# Altium schematic sheet Conditioning.SchDoc
size 381 x 279 mm; Organization: SACO Technologies; Address1: 7806, Trans-Canada Hwy; Address2: Montreal, QC, Canada - H4S1L3.; Address3: H4S1L3; SheetNumber: 4; SheetTotal: 6; ELE682ProjectName: Conditioning & TLL PCB; ProjectRevision: C; SchDesignedBy1: Alexis Gagnon; SchDesignedBy2: Megane Cyr
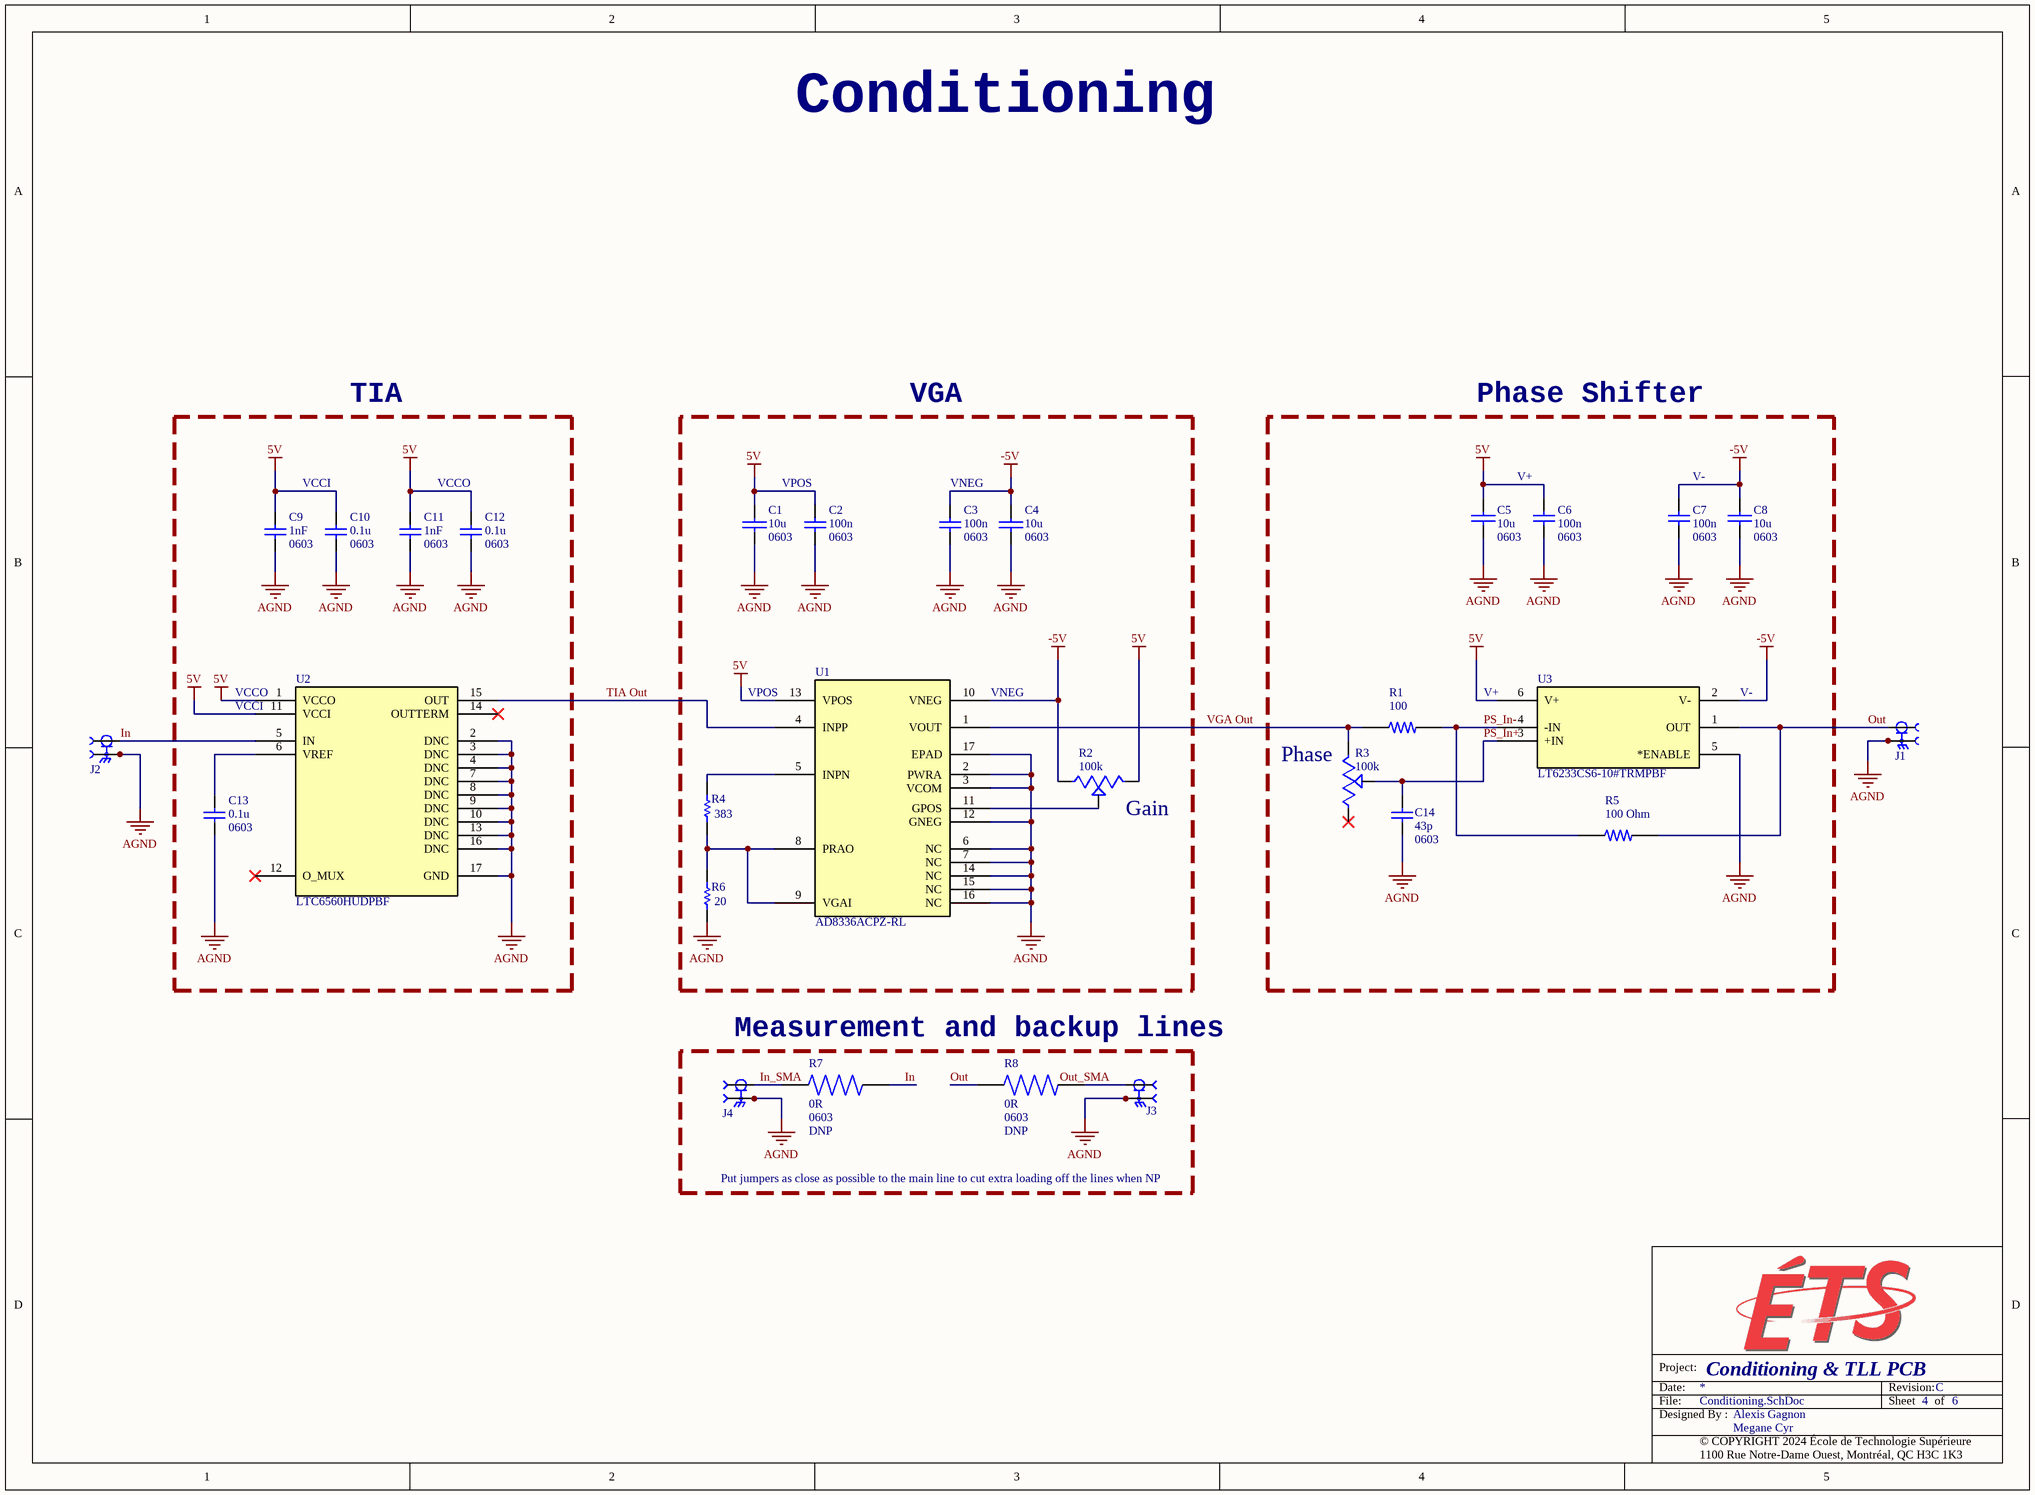
[diagram p0: Conditioning.SchDoc]

## Parts
C1  value 10u  Package: 0603  [C0603-V2]  (hidden comment: GRM188Z71A106KA73J)
C2  value 100n  Package: 0603  [C0603-V2]  (hidden comment: CL10B104KB8NNWC)
C3  value 100n  Package: 0603  [C0603-V2]  (hidden comment: CL10B104KB8NNWC)
C4  value 10u  Package: 0603  [C0603-V2]  (hidden comment: GRM188Z71A106KA73J)
C5  value 10u  Package: 0603  [C0603-V2]  (hidden comment: GRM188Z71A106KA73J)
C6  value 100n  Package: 0603  [C0603-V2]  (hidden comment: CL10B104KB8NNWC)
C7  value 100n  Package: 0603  [C0603-V2]  (hidden comment: CL10B104KB8NNWC)
C8  value 10u  Package: 0603  [C0603-V2]  (hidden comment: GRM188Z71A106KA73J)
C9  value 1nF  Package: 0603  [C0603-V2]  (hidden comment: CL10B102KB8NNNC)
C10  value 0.1u  Package: 0603  [C0603-V2]  (hidden comment: CL10B104KB8NNNC)
C11  value 1nF  Package: 0603  [C0603-V2]  (hidden comment: CL10B102KB8NNNC)
C12  value 0.1u  Package: 0603  [C0603-V2]  (hidden comment: CL10B104KB8NNNC)
C13  value 0.1u  Package: 0603  [CAP_CL10_SAM]  (hidden comment: CL10B104KB8NNNC)
C14  value 43p  Package: 0603  [CAPC1608X90]  (hidden comment: CC0603JRNPO9BN430)
J1  CONSMA001-G  [LINX_CONSMA001-G]  (value not drawn)
J2  CONSMA001-G  [LINX_CONSMA001-G]  (value not drawn)
J3  EMPCB.SMAFSTJ.B.HT  [SMA Connector]  (value not drawn)
J4  EMPCB.SMAFSTJ.B.HT  [SMA Connector]  (value not drawn)
R1  value 100  [RESC1607X60N]  (hidden comment: RC0603FR-07100RL)
R2  value 100k  [TRIM_3214W-1-104E]  (hidden comment: 3214W-1-104E)
R3  value 100k  [TRIM_3214W-1-104E]  (hidden comment: 3214W-1-104E)
R4  value 383  [RESC1608X55X25LL10T15]  (hidden comment: RC0603FR-07383RL)
R5  value 100 Ohm  [RESC1607X60N]  (hidden comment: RC0603FR-07100RL)
R6  value 20  [RESC1608X55X25NL10T15]  (hidden comment: RC0603JR-0720RL)
R7  value 0R  Package: 0603  [RESC1508X55N]  (hidden comment: RMCF0603ZT0R00)
R8  value 0R  Package: 0603  [RESC1508X55N]  (hidden comment: RMCF0603ZT0R00)
U1  AD8336ACPZ-RL  [CP_16_4_ADI]
U2  LTC6560HUDPBF  [QFN16_UD_ADI]
U3  LT6233CS6-10#TRMPBF  [TSOT-23_S6_LIT]

## Blocks framed on the sheet
TIA: C9-C13 U2
VGA: C1-C4 R2 R4 R6 U1
Phase Shifter: C5-C8 C14 R1 R3 R5 U3
Measurement and backup lines: J3 J4 R7 R8

## Nets
5V: C1.1 C2.2 C5.1 C6.2 C9.2 C10.2 C11.2 C12.2 R2.3(CW) U1.13(VPOS) U2.1(VCCO) U2.11(VCCI) U3.6(V+)
-5V: C3.2 C4.1 C7.2 C8.1 R2.1(CCW) U1.10(VNEG) U3.2(V-)
AGND: C1.2 C2.1 C3.1 C4.2 C5.2 C6.1 C7.1 C8.2 C9.1 C10.1 C11.1 C12.1 C13.1 C14.2 J1.S1 J1.S2 J1.S3 J1.S4 J2.S1 J2.S2 J2.S3 J2.S4 J3.SH1 J3.SH2 J3.SH3 J3.SH4 J4.SH1 J4.SH2 J4.SH3 J4.SH4 R6.2 U1.2(PWRA) U1.3(VCOM) U1.6(NC) U1.7(NC) U1.12(GNEG) U1.14(NC) U1.15(NC) U1.16(NC) U1.17(EPAD) U2.2(DNC) U2.3(DNC) U2.4(DNC) U2.7(DNC) U2.8(DNC) U2.9(DNC) U2.10(DNC) U2.13(DNC) U2.16(DNC) U2.17(GND) U3.5(*ENABLE)
In: J2.1 R7.2 U2.5(IN)
In_SMA: J4.1 R7.1
Out: J1.1 R5.2 R8.1 U3.1(OUT)
Out_SMA: J3.1 R8.2
PS_In+: C14.1 R3.2(WIPER) U3.3(+IN)
PS_In-: R1.2 R5.1 U3.4(-IN)
TIA Out: U1.4(INPP) U2.15(OUT)
VGA Out: R1.1 R3.3(CW) U1.1(VOUT)
NetC13_2: C13.2 U2.6(VREF)
NetR2_2: R2.2(WIPER) U1.11(GPOS)
NetR4_1: R4.1 U1.5(INPN)
NetR4_2: R4.2 R6.1 U1.8(PRAO) U1.9(VGAI)

Not connected (* = marked no-connect by the designer): R3 1(CCW)*; U2 12(O_MUX)* 14(OUTTERM)*

## Notes on the sheet
- Conditioning
- VCCI
- VCCO
- VPOS
- (near C3) VNEG
- V+
- V-
- (near U2) VCCI
- (near U2) VCCO
- (near U1) VPOS
- (near U1) VNEG
- (near U3) V+
- (near U3) V-
- (near R3) Phase
- (near R2) Gain
- (near R7) DNP
- (near R8) DNP
- Put jumpers as close as possible to the main line to cut extra loading off the lines when NP
- Project:
- File:
- Date:
- Designed By :
- © COPYRIGHT 2024 École de Technologie Supérieure
- Revision:
- Sheet
- of
- 1100 Rue Notre-Dame Ouest, Montréal, QC H3C 1K3

## Library data of the parts
C1 C4 C5 C8 = GRM188Z71A106KA73J: CAP CER 10UF 10V X7R 0603; Manufacturer: Murata; Dielectric Material: Ceramic; Multilayer: Yes; Tolerance  (fill in as +-): 10%; Supplier: Mouser; Supplier Part Number: 81-GRM188Z71A106KA3J; Manufacturer Part Number: GRM188Z71A106KA73J; RoHS: Yes; Category: Ceramic Capacitors; Stock: 19133; Pricing: 1=0.23, 10=0.121, 50=0.121, 100=0.073, 1000=0.056, 10000=0.041 (USD); Mounting Technology: Surface Mount; Pins: 2; Package Shape: Rectangular; Min Operating Temperature: -55°C; Max Operating Temperature: 125°C; Capacitor Type: Ceramic; Packaging: Tape and Reel; Tolerance (fill in as +-): 10%; Rated DC Voltage (URdc): 10V; Temperature Characteristics Code: X7R; Termination: Wraparound; Reach SVHC Compliant: Yes; RoHS Compliant: Yes; ComponentLink1URL: https://psearch.en.murata.com:443/capacitor/product/GRM188Z71A106KA73%23.pdf?src-supplier=IHS+Markit; ComponentLink1Description: https://psearch.en.murata.com:443/capacitor/product/GRM188Z71A106KA73%23.pdf?src-supplier=IHS+Markit
C2 C3 C6 C7 = CL10B104KB8NNWC: CAP CER 0.1UF 50V X7R 0603; Manufacturer: Samsung; Tolerance: 10%; Supplier: Arrow Electronics; Supplier Part Number: CL10B104KB8NNWC; Manufacturer Part Number: CL10B104KB8NNWC; RoHS: Yes; Category: Ceramic Capacitors; Stock: 4312000; Pricing: 4000=0.0024 (USD); Mounting Technology: Surface Mount; Case Code (Metric): 1608; Case Code (Imperial): 0603; Min Operating Temperature: -55°C; Max Operating Temperature: 125°C; Package Quantity: 1; Packaging: Cut Tape; Voltage Rating: 50V; Series: CL; Length: 0.063inch; Width: 0.031inch; Thickness: 0.035inch; RoHS Compliant: Yes; ComponentLink1URL: https://datasheet.ciiva.com/25740/cl10b104kb8nnwc-25740227.pdf?src-supplier=Digikey; ComponentLink1Description: https://datasheet.ciiva.com/25740/cl10b104kb8nnwc-25740227.pdf?src-supplier=Digikey
C9 C11 = CL10B102KB8NNNC: CAP CER 1000PF 50V X7R 0603; Manufacturer: Samsung; Material: Ceramic; Tolerance: 10%; Supplier: Arrow Electronics; Supplier Part Number: CL10B102KB8NNNC; Manufacturer Part Number: CL10B102KB8NNNC; RoHS: Yes; Category: Ceramic Capacitors; Stock: 8676000; Pricing: 4000=0.006, 8000=0.004, 28000=0.0039, 100000=0.0035 (USD); Mounting Technology: Surface Mount; Case Code (Metric): 1608; Case Code (Imperial): 0603; Min Operating Temperature: -55°C; Max Operating Temperature: 125°C; Dielectric: X7R; Package Quantity: 1; Packaging: Tape and Reel; Voltage Rating: 50V; Voltage: 50V; Voltage Rating (DC): 50V; Series: CL; Construction: Flat; Length: 1.6mm; Width: 0.031inch; Height: 0.8mm; Thickness: 0.035inch; Depth: 0.8mm; Radiation Hardening: No; Lead Free: Lead Free; RoHS Compliant: Yes; ComponentLink1URL: https://datasheet.ciiva.com/25805/cl10b102kb8nnnc-25805137.pdf?src-supplier=Digikey; ComponentLink1Description: https://datasheet.ciiva.com/25805/cl10b102kb8nnnc-25805137.pdf?src-supplier=Digikey; ComponentLink2URL: https://datasheet.ciiva.com/15216/getdatasheetpartid-359690-15216231.pdf?src-supplier=Verical; ComponentLink2Description: https://datasheet.ciiva.com/15216/getdatasheetpartid-359690-15216231.pdf?src-supplier=Verical; ComponentLink3URL: https://datasheet.ciiva.com/29198/458300-da-01-en-vs-kondensator-0603-29198498.pdf?src-supplier=Conrad; ComponentLink3Description: https://datasheet.ciiva.com/29198/458300-da-01-en-vs-kondensator-0603-29198498.pdf?src-supplier=Conrad; ComponentLink4URL: https://datasheet.ciiva.com/26310/mlcc-catalogdownload2013-eng-26310326.pdf?src-supplier=Distrelec; ComponentLink4Description: https://datasheet.ciiva.com/26310/mlcc-catalogdownload2013-eng-26310326.pdf?src-supplier=Distrelec; ComponentLink5URL: https://datasheet.ciiva.com/16199/cl05b104kq5nnnc-16199064.pdf?src-supplier=Future+Electronics; ComponentLink5Description: https://datasheet.ciiva.com/16199/cl05b104kq5nnnc-16199064.pdf?src-supplier=Future+Electronics
C10 C12 C13 = CL10B104KB8NNNC_1: CAP CER 0.1UF 50V X7R 0603; Manufacturer_Name: Samsung; Copyright: Copyright (C) 2025 Ultra Librarian. All rights reserved.; Manufacturer_Part_Number: CL10B104KB8NNNC
C14 = CC0603JRNPO9BN430: CAP CER 43PF 50V C0G/NPO 0603; Price: None; MP: CC0603JRNPO9BN430; Availability: Unavailable
J1 J2 = CONSMA001-G: CONN SMA RCPT STR 50 OHM PCB; Value: 50ohm; Package: None; Price: None; MP: CONSMA001-G; Availability: Unavailable
J3 J4 = SMA Connector: SMA Connector Jack, Female Socket 50Ohm Board Edge, End Launch Solder; MF: Taoglas Limited; Value: *; SnapEDA_Link: https://www.snapeda.com/parts/EMPCB.SMAFSTJ.B.HT/Taoglas+Limited/view-part/?ref=snap; MP: EMPCB.SMAFSTJ.B.HT; Purchase-URL: https://pricing.snapeda.com/search/part/EMPCB.SMAFSTJ.B.HT/?ref=eda; Check_prices: https://www.snapeda.com/parts/EMPCB.SMAFSTJ.B.HT/Taoglas+Limited/view-part/?ref=eda; Availability: In Stock; Price: None; Package: None
R1 R5 = RC0603FR-07100RL: RES SMT 100R 1% 0603 T/R PICK#92931; Package: None; MP: RC0603FR-07100RL; Availability: Unavailable; Price: None
R2 R3 = 3214W-1-104E: TRIMMER 100KOHM 0.25W J LEAD TOP; MF: Bourns; Digi-Key_Part_Number: 3214W-104ETR-ND; Package: NON STANDARD Bourns; SnapEDA_Link: https://www.snapeda.com/parts/3214W-1-104E/Bourns/view-part/?ref=snap; MP: 3214W-1-104E; Purchase-URL: https://pricing.snapeda.com/search/part/3214W-1-104E/?ref=eda; Check_prices: https://www.snapeda.com/parts/3214W-1-104E/Bourns/view-part/?ref=eda
R4 = CMP-2000-04031-1: Manufacturer: Yageo; Part Number: RC0603FR-07383RL
R6 = CMP-2000-04254-1: Manufacturer: Yageo; Part Number: RC0603JR-0720RL
R7 R8 = RMCF0603ZT0R00: 0 Ohms Jumper 0.1W, 1/10W Chip Resistor 0603 (1608 Metric) Automotive AEC-Q200 Thick Film; MF: Stackpole Electronics; SnapEDA_Link: https://www.snapeda.com/parts/RMCF0603ZT0R00/Stackpole+Electronics+Inc/view-part/?ref=snap; MP: RMCF0603ZT0R00; Check_prices: https://www.snapeda.com/parts/RMCF0603ZT0R00/Stackpole+Electronics+Inc/view-part/?ref=eda
U1 = AD8336ACPZ-RL: General-Purpose, âˆ’55Â°C to +125Â°C, Wide Bandwidth, DC-Coupled VGA; Manufacturer_Name: Analog Devices Inc; Copyright: Copyright (C) 2025 Ultra Librarian. All rights reserved.; Manufacturer_Part_Number: AD8336ACPZ-RL; Datasheet: https://www.analog.com/media/en/technical-documentation/data-sheets/AD8336.pdf; RefDes: RefDes; Type: Type
U2 = LTC6560HUDPBF: No Description Available; Mfr_Name: Analog Devices Inc; RefDes: RefDes; Type: Type
U3 = LT6233CS6-10TRMPBF: 60MHz, Rail-to-Rail Output, 1.9nV/âˆšHz, 1.2mA Op Amp Family; Manufacturer_Name: Analog Devices Inc; Copyright: Copyright (C) 2025 Ultra Librarian. All rights reserved.; Manufacturer_Part_Number: LT6233CS6-10#TRMPBF; Datasheet: https://www.analog.com/media/en/technical-documentation/data-sheets/623345fc.pdf; RefDes: RefDes; Type: Type